# EAGLE schematic MicroKeyboard (EAGLE 9.6.2)
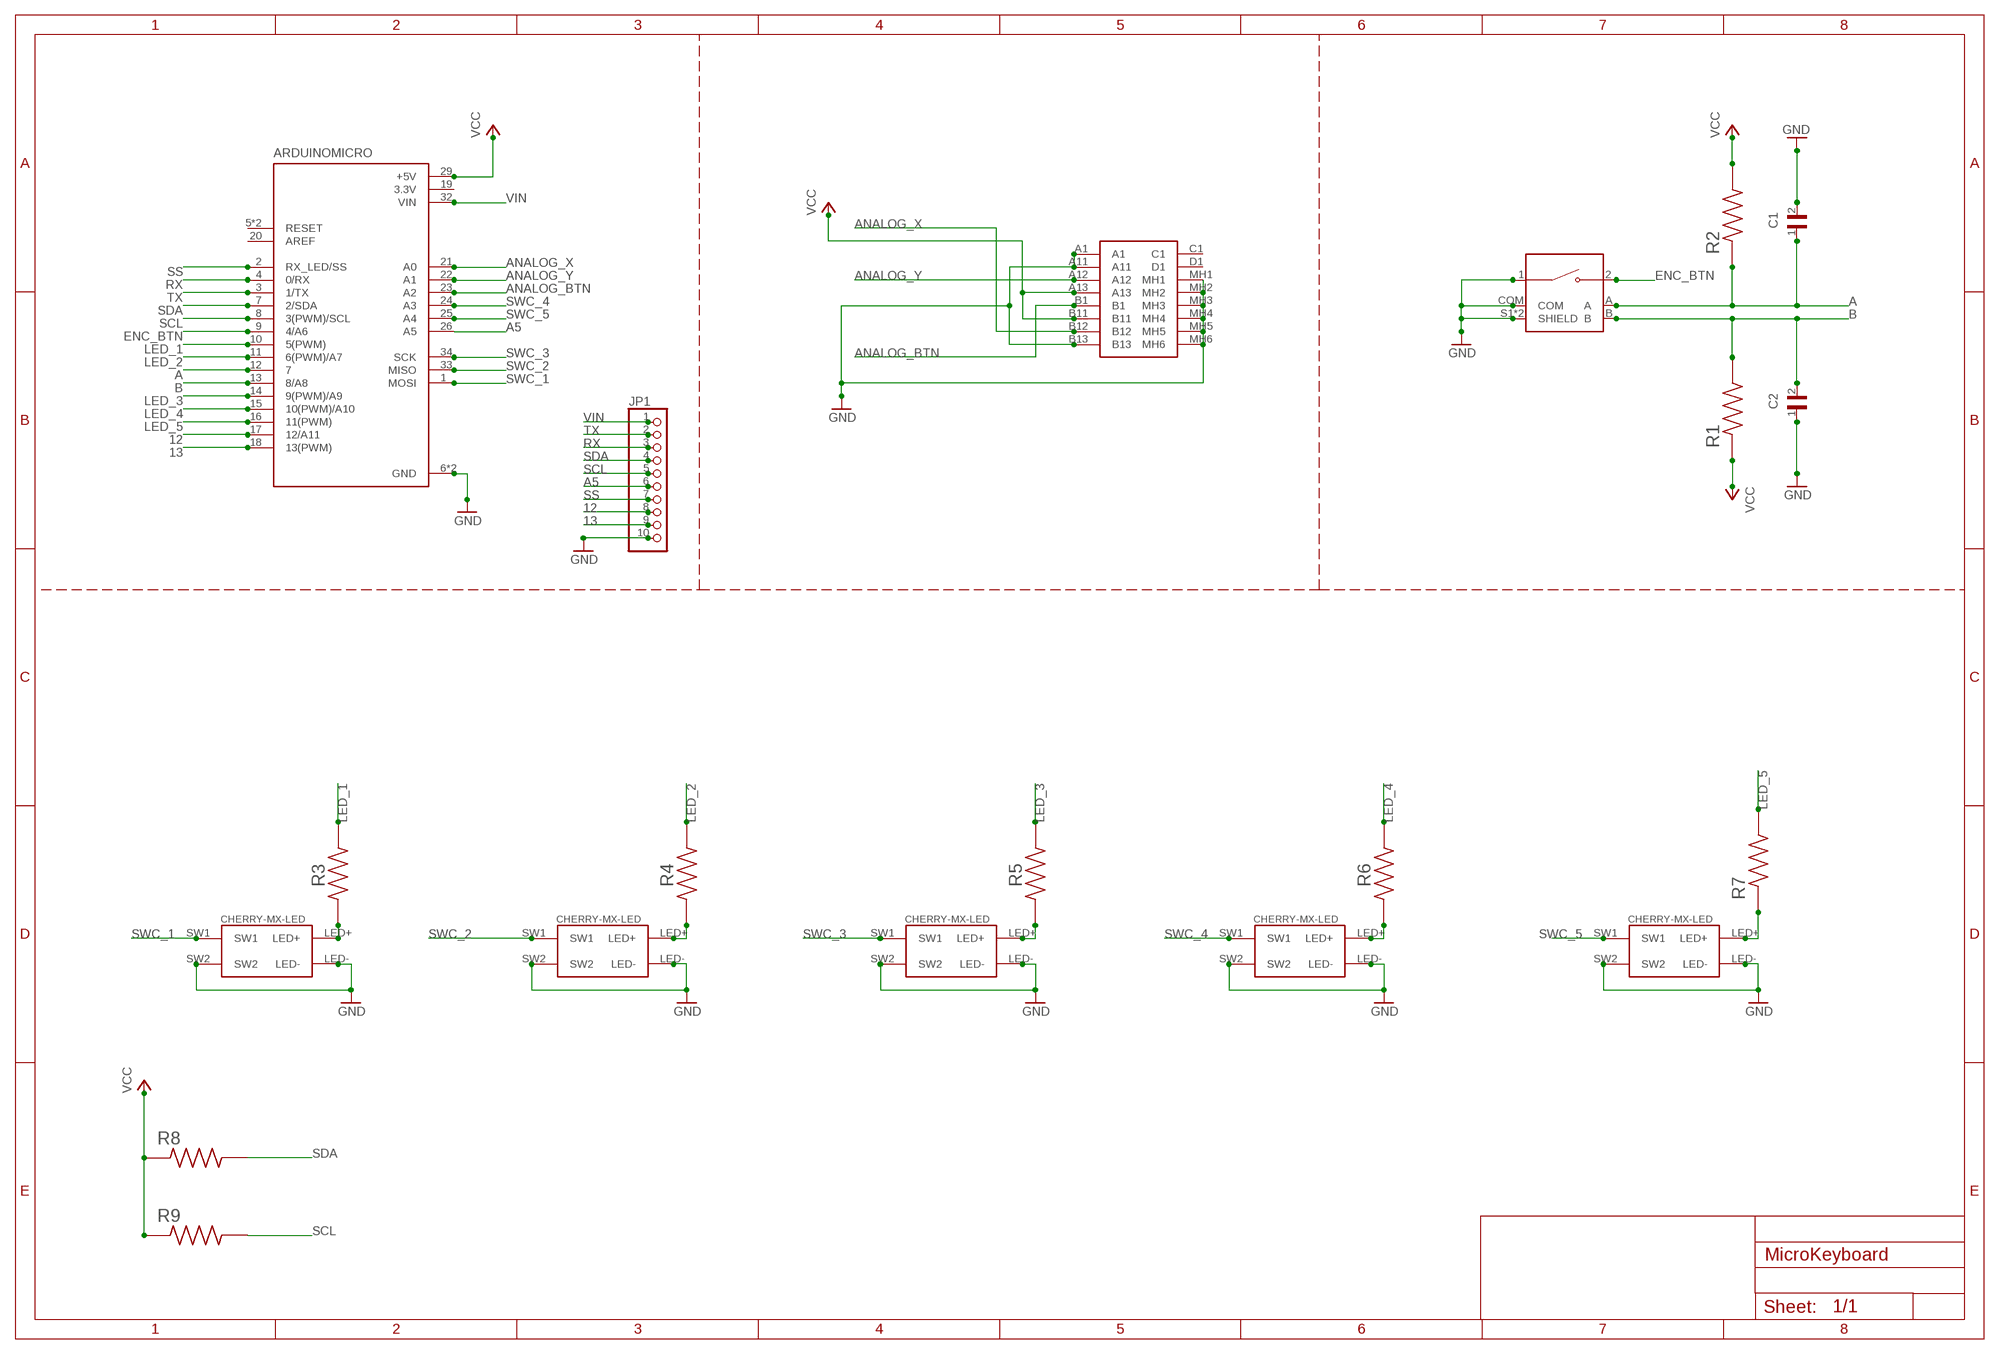
[diagram p0: schematic, sheet 1]

## Parts
ARDUINOMICRO  A000053  [ARDUINO_A000053]
C1  0805YC103J4T2A  [CAPC2012X94N]
C2  0805YC103J4T2A  [CAPC2012X94N]
JP1  PINHD-1X10  [1X10]
MT1  PEC11R-4215F-S0024  [XDCR_PEC11R-4215F-S0024]
R1  RC0805FR-07330RL  [RESC2012X60N]
R2  RC0805FR-07330RL  [RESC2012X60N]
R3  RC0805FR-07330RL  [RESC2012X60N]
R4  RC0805FR-07330RL  [RESC2012X60N]
R5  RC0805FR-07330RL  [RESC2012X60N]
R6  RC0805FR-07330RL  [RESC2012X60N]
R7  RC0805FR-07330RL  [RESC2012X60N]
R8  RC0805FR-07330RL  [RESC2012X60N]
R9  RC0805FR-07330RL  [RESC2012X60N]
S1  RKJXV122400R  [RKJXV122400R]
SWC_1  SWC_1  CHERRY-MX-LED  [CHERRY-MX-LED]
U$1  CHERRY-MX-LED  [CHERRY-MX-LED]
U$2  CHERRY-MX-LED  [CHERRY-MX-LED]
U$3  CHERRY-MX-LED  [CHERRY-MX-LED]
U$5  CHERRY-MX-LED  [CHERRY-MX-LED]

## Nets
12: ARDUINOMICRO.17(12/A11) JP1.8
13: ARDUINOMICRO.18(13(PWM)) JP1.9
A: ARDUINOMICRO.12 C1.1 MT1.A R2.1
A5: ARDUINOMICRO.26(A5) JP1.6
ANALOG_BTN: ARDUINOMICRO.23(A2) S1.B1
ANALOG_X: ARDUINOMICRO.21(A0) S1.B12
ANALOG_Y: ARDUINOMICRO.22(A1) S1.A12
B: ARDUINOMICRO.13(8/A8) C2.2 MT1.B R1.2
ENC_BTN: ARDUINOMICRO.9(4/A6) MT1.2
GND: ARDUINOMICRO.6(GND) ARDUINOMICRO.31(GND) C1.2 C2.1 JP1.10 MT1.1 MT1.COM MT1.S1(SHIELD) MT1.S2(SHIELD) S1.A1 S1.A11 S1.B13 S1.MH1 S1.MH2 S1.MH3 S1.MH4 S1.MH5 S1.MH6 SWC_1.LED- SWC_1.SW2 U$1.LED- U$1.SW2 U$2.LED- U$2.SW2 U$3.LED- U$3.SW2 U$5.LED- U$5.SW2
LED_1: ARDUINOMICRO.10(5(PWM)) R3.2
LED_2: ARDUINOMICRO.11(6(PWM)/A7) R4.2
LED_3: ARDUINOMICRO.14(9(PWM)/A9) R5.2
LED_4: ARDUINOMICRO.15(10(PWM)/A10) R6.2
LED_5: ARDUINOMICRO.16(11(PWM)) R7.2
N$1: R3.1 SWC_1.LED+
N$2: R7.1 U$3.LED+
N$3: R5.1 U$1.LED+
N$4: R4.1 U$5.LED+
N$5: R6.1 U$2.LED+
RX: ARDUINOMICRO.4(0/RX) JP1.3
SCL: ARDUINOMICRO.8(3(PWM)/SCL) JP1.5 R9.2
SDA: ARDUINOMICRO.7(2/SDA) JP1.4 R8.2
SS: ARDUINOMICRO.2(RX_LED/SS) JP1.7
SWC_1: ARDUINOMICRO.1(MOSI) SWC_1.SW1
SWC_2: ARDUINOMICRO.33(MISO) U$5.SW1
SWC_3: ARDUINOMICRO.34(SCK) U$1.SW1
SWC_4: ARDUINOMICRO.24(A3) U$2.SW1
SWC_5: ARDUINOMICRO.25(A4) U$3.SW1
TX: ARDUINOMICRO.3(1/TX) JP1.2
VCC: ARDUINOMICRO.29(+5V) R1.1 R2.2 R8.1 R9.1 S1.A13 S1.B11
VIN: ARDUINOMICRO.32(VIN) JP1.1
Unconnected: ARDUINOMICRO.5(RESET) ARDUINOMICRO.20(AREF) ARDUINOMICRO.30(RESET) S1.C1 S1.D1

## Power pins joined to a net without a drawn wire
3.3V: ARDUINOMICRO.19(3.3V)

## Library data of the parts
ARDUINOMICRO = A000053:A000053: MCU, ARDUINO MICRO, LEONARDO BASED, ATMEGA32u4, 5V, USB-MICRO Check availability <https://pricing.snapeda.com/parts/Arduino%20Micro/Arduino/view-part?ref=eda>; AVAILABILITY: Not in stock; DESCRIPTION: Microcontroller board based on the ATmega32u4; MF: Arduino; MP: Arduino Micro; PACKAGE: Non-Standard Arduino; PRICE: None
C1 C2 = 0805YC103J4T2A:0805YC103J4T2A: Cap Ceramic 0.01uF 16V X7R 5% SMD 0805 125°C Paper T/R Check availability <https://pricing.snapeda.com/parts/0805YC103J4T2A/AVX/view-part?ref=eda>; AVAILABILITY: In Stock; DESCRIPTION: 10000 pF ±5% 16V Ceramic Capacitor X7R 0805 (2012 Metric); MF: AVX; MP: 0805YC103J4T2A; PACKAGE: 2012 AVX; PRICE: None; PURCHASE-URL: https://pricing.snapeda.com/search/part/0805YC103J4T2A/?ref=eda
JP1 = pinhead:PINHD-1X10: PIN HEADER
MT1 = PEC11R-4215F-S0024:PEC11R-4215F-S0024: Incremental Encoder, 12 Mm, Contact Rating 10 Ma - 5 Vdc Check availability <https://pricing.snapeda.com/parts/PEC11R-4215F-S0024/Bourns/view-part?ref=eda>; AVAILABILITY: In Stock; DESCRIPTION: Rotary Encoder Mechanical 24 Quadrature (Incremental) Vertical; MF: Bourns; MP: PEC11R-4215F-S0024; PACKAGE: None; PRICE: None; PURCHASE-URL: https://pricing.snapeda.com/search/part/PEC11R-4215F-S0024/?ref=eda
R1-R9 = RC0805FR-07330RL:RC0805FR-07330RL: Resistor SMD [YAGEO] RC0805FR-07330RL Resistor SMD Check availability <https://pricing.snapeda.com/parts/RC0805FR-07330RL/Yageo/view-part?ref=eda>; AVAILABILITY: In Stock; DESCRIPTION: 330 Ohms ±1% 0.125W, 1/8W Chip Resistor 0805 (2012 Metric) Moisture Resistant Thick Film; MF: Yageo; MP: RC0805FR-07330RL; PACKAGE: 2012 Rohm Semiconductor; PRICE: None; PURCHASE-URL: https://pricing.snapeda.com/search/part/RC0805FR-07330RL/?ref=eda
S1 = RKJXV122400R:RKJXV122400R: RKJXV122400R Source: Datasheet <https://tech.alpsalpine.com/prod/e/html/multicontrol/potentiometer/rkjxk/rkjxv122400r.html>; DESCRIPTION: RKJXV122400R; HEIGHT: 18.95mm; MANUFACTURER_NAME: ALPS Electric; MANUFACTURER_PART_NUMBER: RKJXV122400R; MOUSER_PART_NUMBER: 688-RKJXV122400R; MOUSER_PRICE-STOCK: https://www.mouser.co.uk/ProductDetail/Alps-Alpine/RKJXV122400R?qs=GedFDFLaBXEbB%252ByoOVwLBg%3D%3D
SWC_1 U$1-U$3 U$5 = cherrymx:CHERRY-MX-LED: Cherry MX series keyswitch with LED